# EAGLE design RasPi-BplusHAT-3v3 (EAGLE 9.6.2)
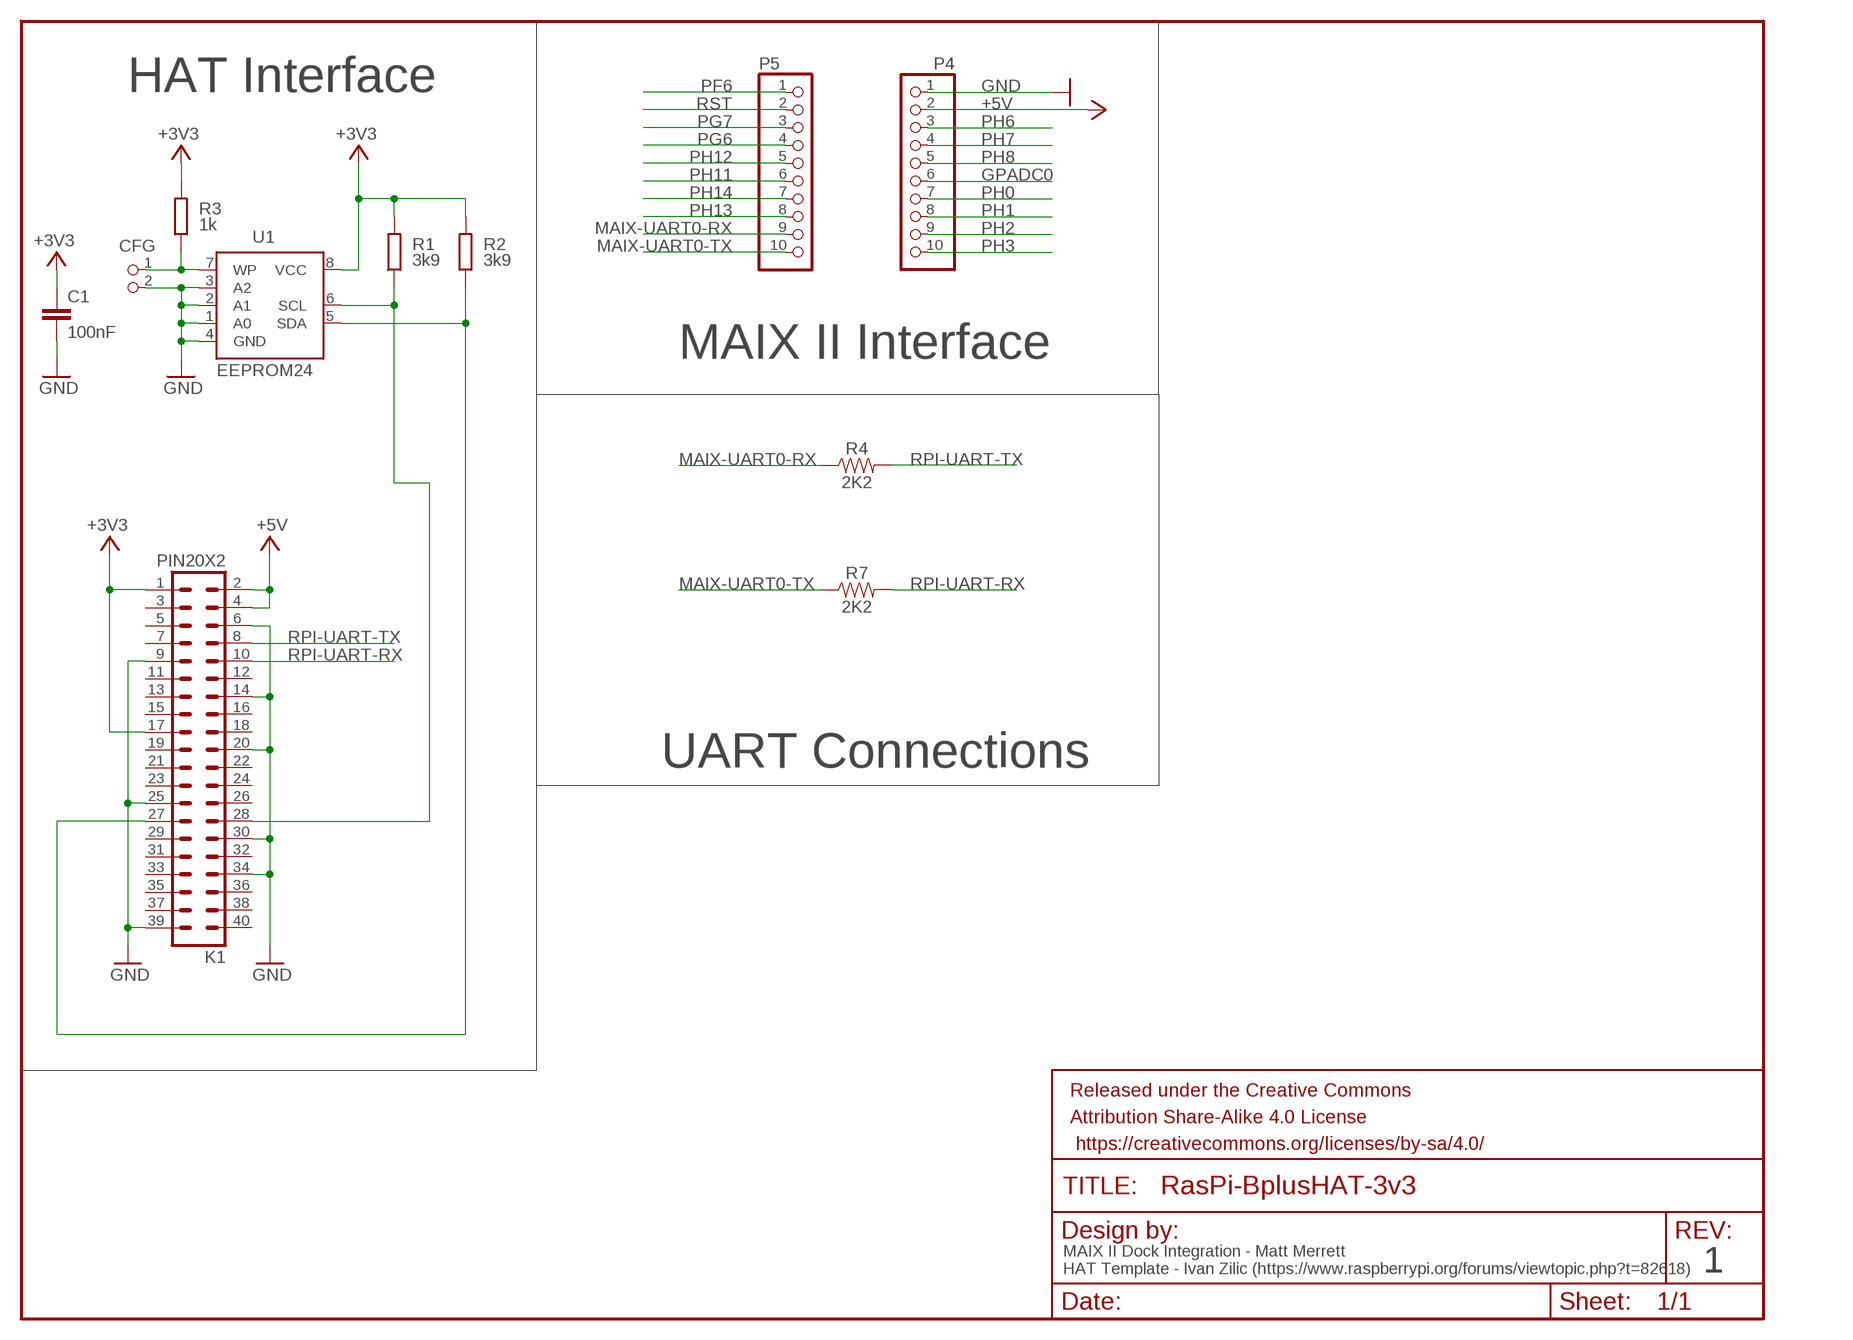
[diagram p0: schematic, sheet 1]

## Parts
C1  100nF  C-EUC0805K  [C0805K]
CFG  PIN2_100  [PIN_W_2]
FRAME1  FRAME-LETTER  [CREATIVE_COMMONS]
K1  PIN20X2  [PIN_20X2]
P4  PINHD-1X10  [1X10]
P5  PINHD-1X10  [1X10]
R1  3k9  R-EU_M0805  [M0805]
R2  3k9  R-EU_M0805  [M0805]
R3  1k  R-EU_M0805  [M0805]
R4  2K2  RESISTORAXIAL-0.3  [AXIAL-0.3]
R7  2K2  RESISTORAXIAL-0.3  [AXIAL-0.3]
U1  EEPROM24  [SOIC8]

## Nets
+3V3: C1.1 K1.1 K1.17 R1.2 R2.2 R3.2 U1.8(VCC)
+5V [5V]: K1.2 K1.4 P4.2
GND: C1.2 CFG.2 K1.6 K1.9 K1.14 K1.20 K1.25 K1.30 K1.34 K1.39 P4.1 U1.1(A0) U1.2(A1) U1.3(A2) U1.4(GND)
GPADC0: P4.6
MAIX-UART0-RX: P5.9 R4.P$1
MAIX-UART0-TX: P5.10 R7.P$1
N$1: K1.28 R1.1 U1.6(SCL)
N$2: K1.27 R2.1 U1.5(SDA)
N$3: CFG.1 R3.1 U1.7(WP)
PF6: P5.1
PG6: P5.4
PG7: P5.3
PH0: P4.7
PH1: P4.8
PH2: P4.9
PH3: P4.10
PH6: P4.3
PH7: P4.4
PH8: P4.5
PH11: P5.6
PH12: P5.5
PH13: P5.8
PH14: P5.7
RPI-UART-RX: K1.10 R7.P$2
RPI-UART-TX: K1.8 R4.P$2
RST: P5.2
Unconnected: K1.3 K1.5 K1.7 K1.11 K1.12 K1.13 K1.15 K1.16 K1.18 K1.19 K1.21 K1.22 K1.23 K1.24 K1.26 K1.29 K1.31 K1.32 K1.33 K1.35 K1.36 K1.37 K1.38 K1.40

## Notes on the sheet
- HAT Interface
- MAIX II Interface
- UART Connections
- 1
- MAIX II Dock Integration - Matt Merrett
  HAT Template - Ivan Zilic (https://www.raspberrypi.org/forums/viewtopic.php?t=82618)

## Library data of the parts
C1 = resistor:C-EU: CAPACITOR, European symbol; DIELECTRIC: X7R
CFG = FLYFISH:PIN2
FRAME1 = SparkFun-Aesthetics:FRAME-LETTER: Schematic Frame - Letter Standard 8.5x11 US Letter frame
K1 = FLYFISH:PIN20X2
P4 P5 = pinhead:PINHD-1X10: PIN HEADER
R1-R3 = resistor:R-EU_: RESISTOR, European symbol; TOLERANCE: 5%
R4 R7 = SparkFun-Resistors:RESISTOR: Generic Resistor Package
U1 = FLYFISH:EEPROM24

## Net classes
0 default: width 0.254 mm
1 5V: width 0.61 mm

## Board
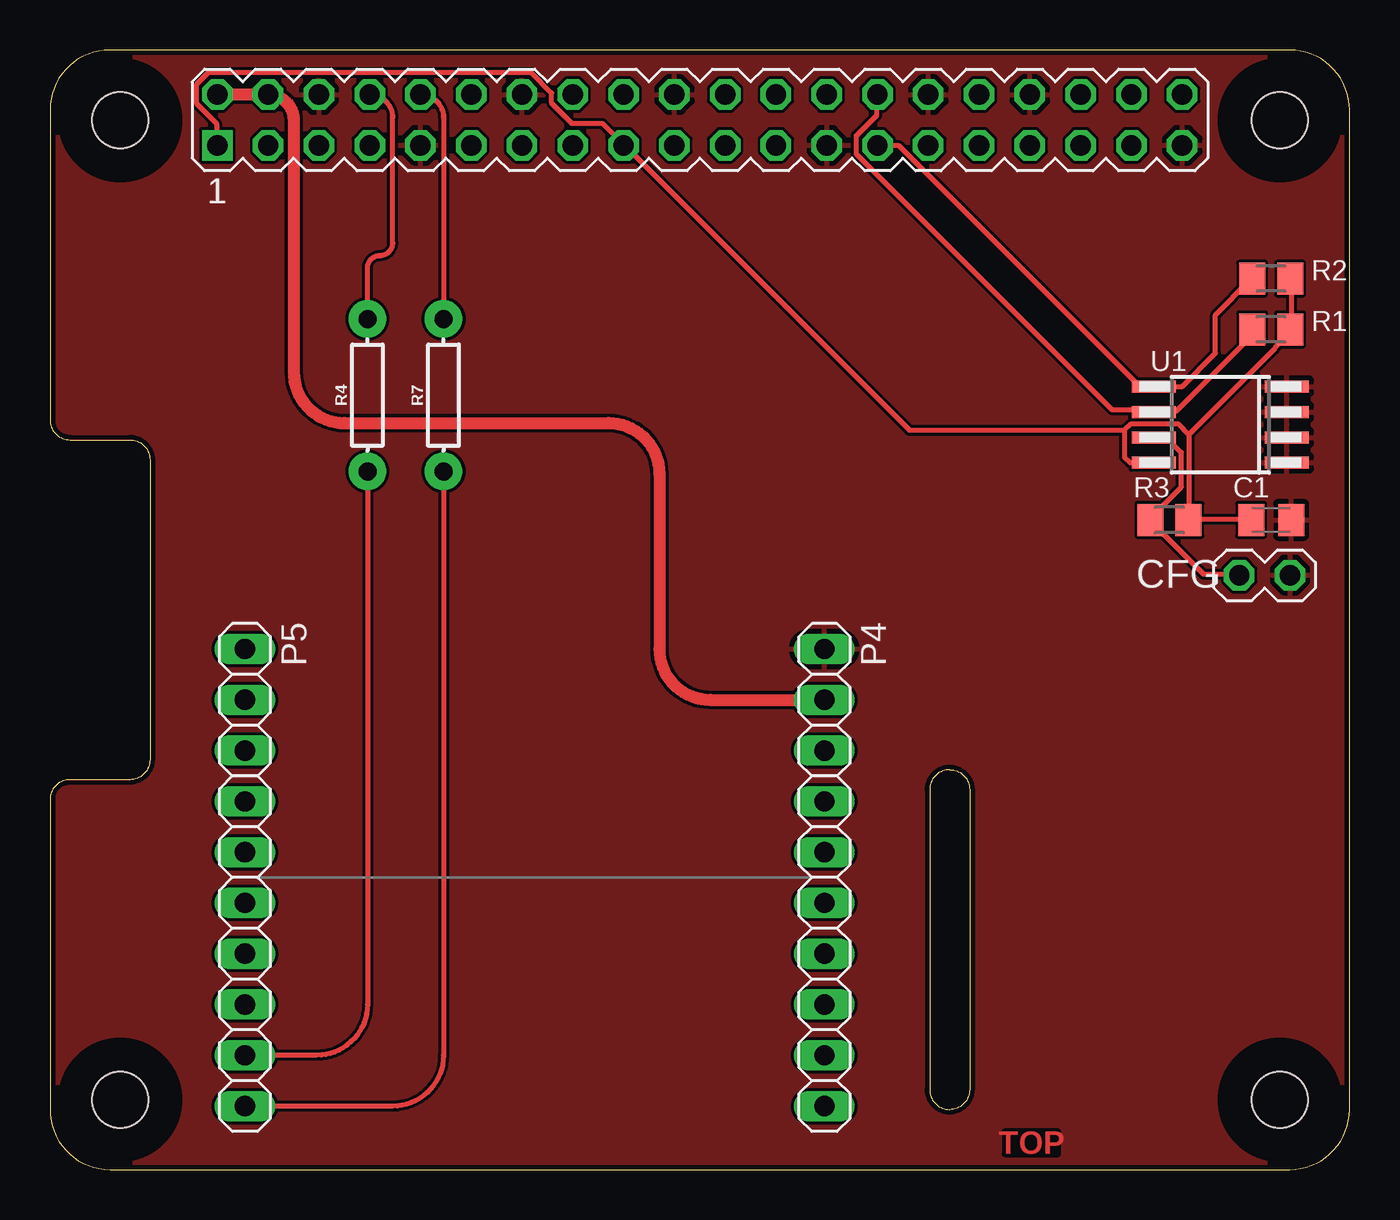
[diagram p1: board, top side]
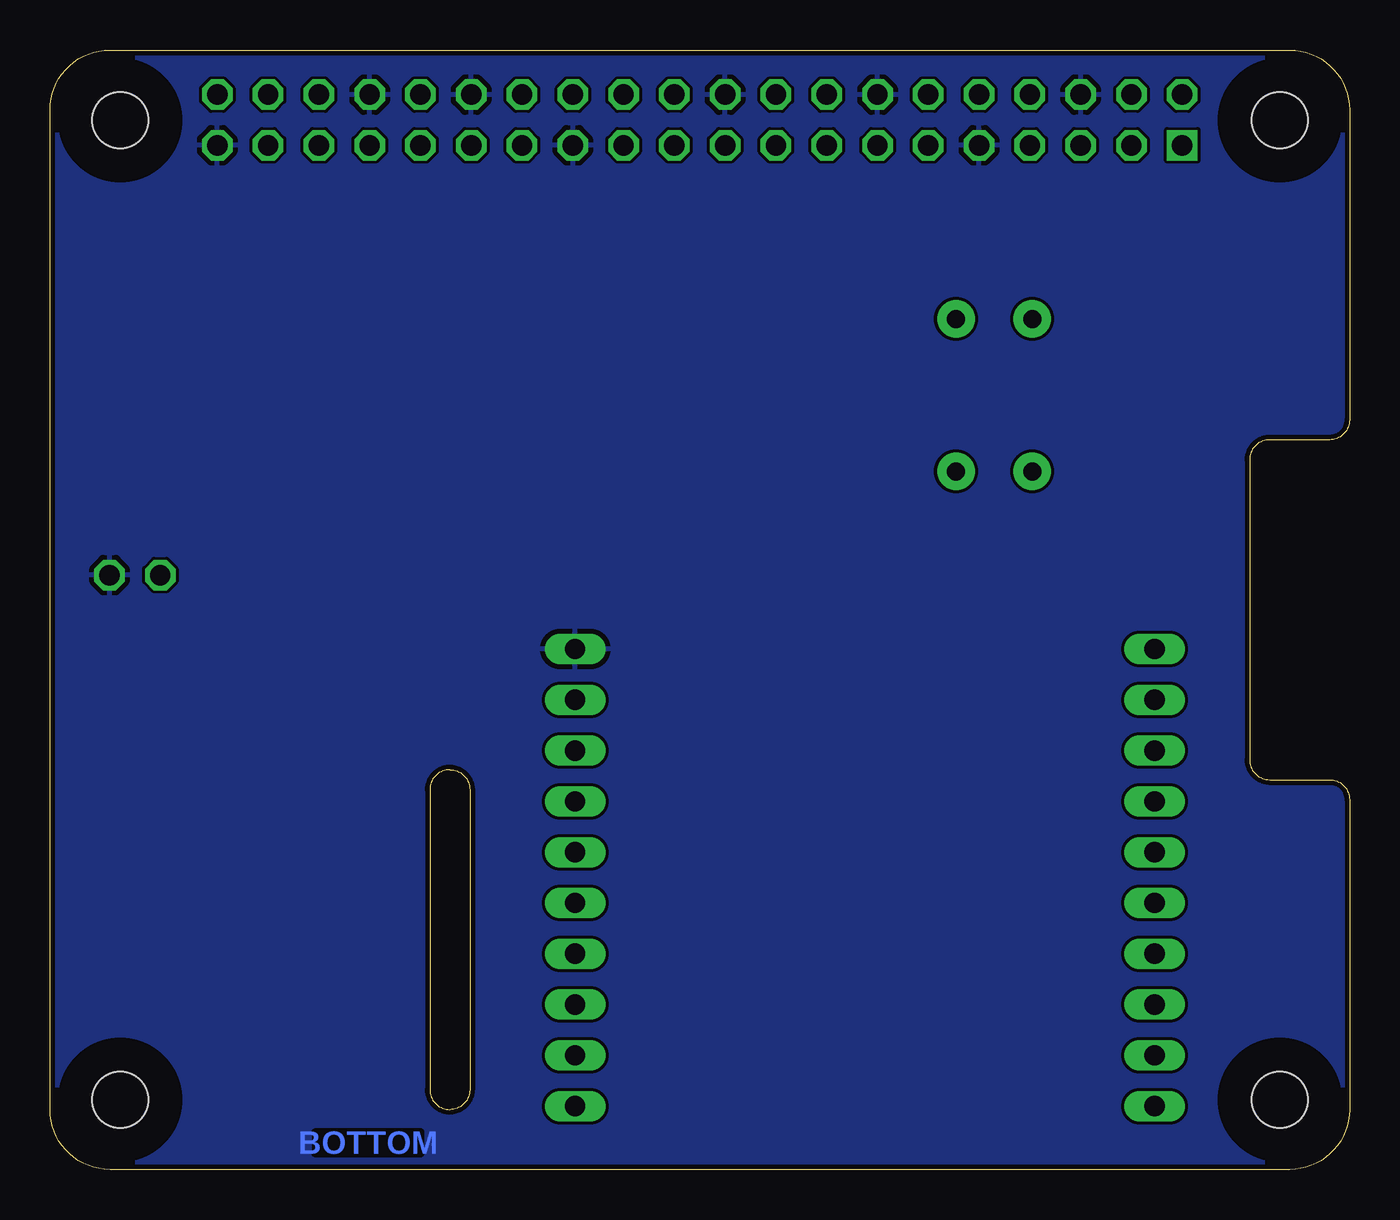
[diagram p2: board, bottom side, seen from below]

Size 65 x 56 mm. Coordinates in mm from the lower left corner, seen from the top.
Outline: 0,3 arc90 3,0 62,0 arc90 65,3 65,53 arc90 62,56 3,56 arc90 0,53 0,37.5 arc90 1,36.5 4,36.5 arc-90 5,35.5 5,20.5 arc-90 4,19.5 1,19.5 arc90 0,18.5 0,3
Outline: 44,19 44,4 arc90 45,3 arc90 46,4 46,19 arc90 45,20 arc90 44,19
Copper layers (1*16): Top 0.035mm / dielectric 1.5mm / Bottom 0.035mm
Design rules "ITEADstudio_DRC": minimum track width 6mil, minimum drill 12mil, track to track 6mil, track to pad 6mil, pad to pad 6mil, via to via 6mil, smd to smd 0mil, copper to edge 10mil, drill to drill 10mil, minimum pad ring 10mil, minimum via ring 6mil, stop-mask expansion 2mil, vias tented up to drill 100mil, thermal gap 10mil
Holes 2.8 mm at 3.5,3.5 3.5,52.5 61.5,52.5 61.5,3.5
tRestrict: area 1.9,51 to 5,54; area 60,51 to 63,54; area 60,1.9 to 63,5; area 1.9,1.9 to 5,5
bRestrict: area 1.9,1.9 to 5,5; area 1.9,51 to 5,54; area 60,1.9 to 63,5; area 60,51 to 63,54
Milling: 6 lines

### Footprints (pad centres in the part's own frame; a part is rotated, then mirrored left to right if it is on the bottom)
C0805K = smd 1.3 x 1.6: 1 -1,0; 2 1,0
PIN_W_2 = drill 1.016 octagon: 1 0,0; 2 0,-2.54
PIN_20X2 = drill 1.016 square: 1 -24.13,-1.27 | drill 1.016 octagon: 2 -24.13,1.27; 3 -21.59,-1.27; 4 -21.59,1.27; 5 -19.05,-1.27; 6 -19.05,1.27; 7 -16.51,-1.27; 8 -16.51,1.27; 9 -13.97,-1.27; 10 -13.97,1.27; 11 -11.43,-1.27; 12 -11.43,1.27; 13 -8.89,-1.27; 14 -8.89,1.27; 15 -6.35,-1.27; 16 -6.35,1.27; 17 -3.81,-1.27; 18 -3.81,1.27; 19 -1.27,-1.27; 20 -1.27,1.27; 21 1.27,-1.27; 22 1.27,1.27; 23 3.81,-1.27; 24 3.81,1.27; 25 6.35,-1.27; 26 6.35,1.27; 27 8.89,-1.27; 28 8.89,1.27; 29 11.43,-1.27; 30 11.43,1.27; 31 13.97,-1.27; 32 13.97,1.27; 33 16.51,-1.27; 34 16.51,1.27; 35 19.05,-1.27; 36 19.05,1.27; 37 21.59,-1.27; 38 21.59,1.27; 39 24.13,-1.27; 40 24.13,1.27
1X10 = drill 1.016 long: 1 -11.43,0; 2 -8.89,0; 3 -6.35,0; 4 -3.81,0; 5 -1.27,0; 6 1.27,0; 7 3.81,0; 8 6.35,0; 9 8.89,0; 10 11.43,0
M0805 = smd 1.3 x 1.6: 1 -0.95,0; 2 0.95,0
AXIAL-0.3 = drill 0.9 pad 1.88: P$1 -3.81,0; P$2 3.81,0
SOIC8 = smd 0.6 x 2.2: 1 -1.905,-3.33; 2 -0.635,-3.33; 3 0.635,-3.33; 4 1.905,-3.33; 5 1.905,3.33; 6 0.635,3.33; 7 -0.635,3.33; 8 -1.905,3.33

### Placement (x,y rotation side)
C1  61.08,32.5 0 top
CFG  59.48,29.73 90 top
FRAME1  3.22,-9.84 0 top  (outside the outline)
K1  32.5,52.5 0 top
P4  38.73,14.61 270 top
P5  9.75,14.61 270 top
R1  61.08,42.02 0 top
R2  61.08,44.56 0 top
R3  55.99,32.5 0 top
R4  15.88,38.73 90 top
R7  19.68,38.73 90 top
U1  58.53,37.26 90 top

### Tracks (layer width: path | path; a pad name or v marks a point on that pad's centre or on a via)
+3V3
  Top 0.254: R2.2 62.08,44.5 62.08,42.06 R1.2 61.24,41.03 57.04,36.83 57,36.79 | C1.1 60.05,32.51 57,32.51 R3.2 57,32.61 57,36.79 | 53.75,36.98 53.75,35.64 54.03,35.36 55.17,35.36 U1.8 | 53.75,36.98 54.05,37.29 56.45,37.29 56.97,36.77 57,36.79 | 53.75,36.98 42.98,36.98 28.75,51.21 K1.17 28.65,51.31 27.64,52.32 26.11,52.32 25.09,53.34 25.09,53.85 24.08,54.86 7.92,54.86 7.32,54.25 7.32,53.34 8.33,52.32 8.33,51.31 K1.1
+5V
  Top 0.61: K1.2 K1.4 arc-90 12.19,52.49 12.19,39.88 arc90 14.73,37.34 27.94,37.34 arc-90 30.48,34.8 30.48,26.04 arc90 33.02,23.5 P4.2
GND
  pour Bottom: 0,3 arc90 3,0 62,0 arc90 65,3 65,53 arc90 62,56 3,56 arc90 0,53 0,37.5 arc90 1,36.5 4,36.5 arc-90 5,35.5 5,20.5 arc-90 4,19.5 1,19.5 arc90 0,18.5
  pour Top: 0,3 arc90 3,0 62,0 arc90 65,3 65,53 arc90 62,56 3,56 arc90 0,53 0,37.5 arc90 1,36.5 4,36.5 arc-90 5,35.5 5,20.5 arc-90 4,19.5 1,19.5 arc90 0,18.5
MAIX-UART0-RX
  Top 0.254: 9.27,5.71 P5.9 13.34,5.71 arc90 15.88,8.26 R4.P$1
MAIX-UART0-TX
  Top 0.254: R7.P$1 19.68,5.71 arc-90 17.14,3.17 P5.10
N$1
  Top 0.254: R1.1 60.12,41.73 56.29,37.9 55.27,37.9 U1.6 55.17,38 53.14,38 40.34,50.8 40.34,51.71 41.35,52.73 41.35,53.75 K1.28
N$2
  Top 0.254: R2.1 60.05,44.5 58.29,42.75 58.29,40.83 56.63,39.16 U1.5 | 55.32,39.16 U1.5 | K1.27 41.45,51.21 42.47,51.21 54.46,39.22 55.17,39.22 U1.5
N$3
  Top 0.254: CFG.1 59.44,29.77 57.71,29.77 55.07,32.41 R3.1 55.07,32.61 56.59,34.14 56.59,35.87 55.88,36.58 55.27,36.58 U1.7
RPI-UART-RX
  Top 0.254: K1.10 arc-90 19.68,52.62 R7.P$2
RPI-UART-TX
  Top 0.254: R4.P$2 15.88,45.09 arc-90 16.51,45.72 arc90 17.14,46.35 17.14,52.62 arc90 K1.8

### Text on the board
Top: TOP
Bottom: BOTTOM
tDocu: MAIX II Dock Integration - Matt Merrett / HAT Template - Ivan Zilic (Released for free use)